# Altium schematic sheet Voltage_Conv_Bidirectional.SchDoc
size A; SheetNumber: 14; SheetTotal: 14
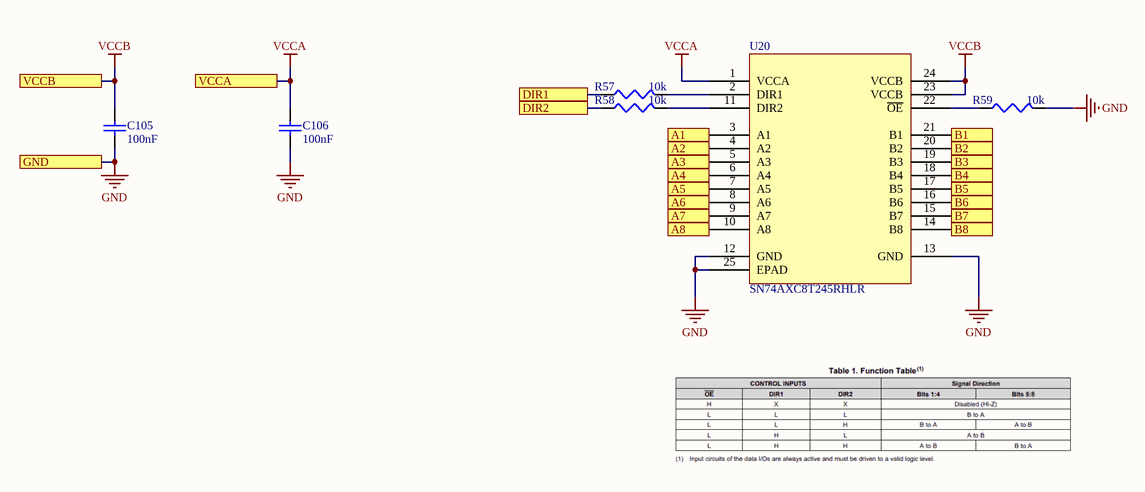
[diagram p0: Voltage_Conv_Bidirectional.SchDoc]

## Parts
C105  100nF  [SMD-0402]
C106  100nF  [SMD-0402]
R57  10k  [SMD-0402]
R58  10k  [SMD-0402]
R59  10k  [SMD-0402]
U20  SN74AXC8T245RHLR  [RHL0024A]

## Ports
A1 (see Main[4B]), A2 (see Main[4B]), A3 (see Main[4B]), A4 (see Main[4B]), A5 (see Main[4B]), A6 (see Main[4B]), A7 (see Main[4B]), A8 (see Main[4B]), B1 (see Main[5B]), B2 (see Main[5B]), B3 (see Main[5B]), B4 (see Main[5B]), B5 (see Main[5B]), B6 (see Main[5B]), B7 (see Main[5B]), B8 (see Main[5B]), DIR1 (see Main[4B]), DIR2 (see Main[4C]), GND (see Main[5C], 3V7_to_3V3_LDO[1B], 5V5_to_5V0_LDO[1C], Buck_TPSM82913_1V8[3C], Buck_TPSM82913_3V7[3C], Buck_TPSM82913_5V0[3C], Buck_TPSM82913_5V5[2C], Clocking_and_LO[2A], IQ_Demod[1C], IQ_Mod[1B], LMX2820[4D], Microzed_Interfaces[1A], Power_Supply[6B]), VCCA (see Main[4B]), VCCB (see Main[5B])

## Nets
GND: C105.1 C106.1 R59.2 U20.12(GND) U20.13(GND) U20.25(EPAD) ; port GND
VCCA: C106.2 U20.1(VCCA) ; port VCCA
VCCB: C105.2 U20.23(VCCB) U20.24(VCCB) ; port VCCB
A1: U20.3(A1) ; port A1
A2: U20.4(A2) ; port A2
A3: U20.5(A3) ; port A3
A4: U20.6(A4) ; port A4
A5: U20.7(A5) ; port A5
A6: U20.8(A6) ; port A6
A7: U20.9(A7) ; port A7
A8: U20.10(A8) ; port A8
B1: U20.21(B1) ; port B1
B2: U20.20(B2) ; port B2
B3: U20.19(B3) ; port B3
B4: U20.18(B4) ; port B4
B5: U20.17(B5) ; port B5
B6: U20.16(B6) ; port B6
B7: U20.15(B7) ; port B7
B8: U20.14(B8) ; port B8
DIR1: R57.1 ; port DIR1
DIR2: R58.1 ; port DIR2
NetR57_2: R57.2 U20.2(DIR1)
NetR58_2: R58.2 U20.11(DIR2)
NetR59_1: R59.1 U20.22(~{OE})

## Library data of the parts
C105 C106 = CAP0402: Ceramic Capacitor 0402
R57-R59 = RES0402: Resistor-0402
U20 = SN74AXC8T245